# EAGLE design Scope+ArduinoCurveTracerV10 (EAGLE 7.3.0)
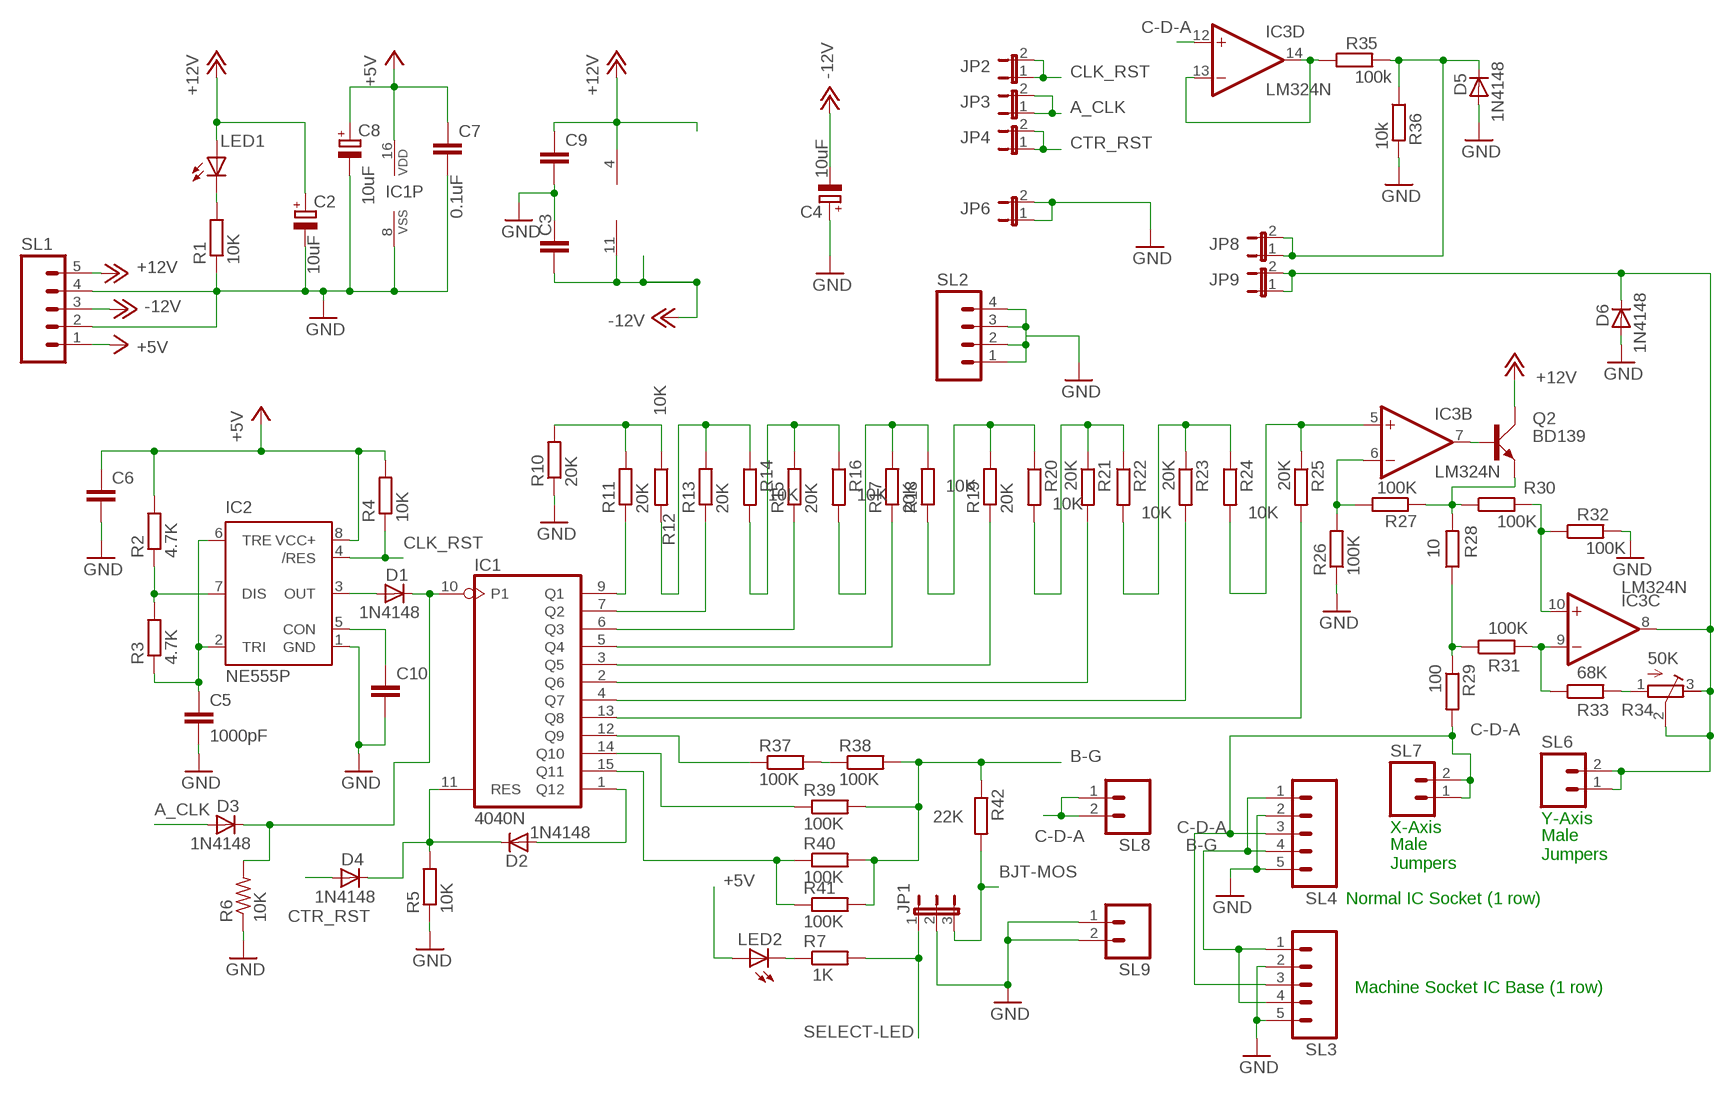
[diagram p0: schematic, sheet 1]

## Parts
C2  10uF  CPOL-EUE2-5  [E2-5]
C3  0.1uF  C-EU025-024X044  [C025-024X044]
C4  10uF  CPOL-EUE2-5  [E2-5]
C5  1000pF  C-EU025-025X050  [C025-025X050]
C6  0.1uF  C-EU025-024X044  [C025-024X044]
C7  0.1uF  C-EU025-024X044  [C025-024X044]
C8  10uF  CPOL-EUE2-5  [E2-5]
C9  0.1uF  C-EU025-024X044  [C025-024X044]
C10  0.1uF  C-EU025-024X044  [C025-024X044]
D1  1N4148  1N4148DO35-7  [DO35-7]
D2  1N4148  1N4148DO35-7  [DO35-7]
D3  1N4148  1N4148DO35-7  [DO35-7]
D4  1N4148  1N4148DO35-7  [DO35-7]
D5  1N4148  1N4148DO35-7  [DO35-7]
D6  1N4148  1N4148DO35-10  [DO35-10]
IC1  4040N  [DIL16]
IC2  NE555P  [DIL-08]
IC3  LM324N  [DIL14]
JP1  JP2E  [JP2]
JP2  JP1E  [JP1]
JP3  JP1E  [JP1]
JP4  JP1E  [JP1]
JP6  JP1E  [JP1]
JP8  JP1E  [JP1]
JP9  JP1E  [JP1]
LED1  LED3MM  [LED3MM]
LED2  LED3MM  [LED3MM]
Q2  BD139  [TO126AV]
R1  10K  R-EU_0204/7  [0204/7]
R2  4.7K  R-EU_0204/7  [0204/7]
R3  4.7K  R-EU_0204/7  [0204/7]
R4  10K  R-EU_0204/7  [0204/7]
R5  10K  R-EU_0204/7  [0204/7]
R6  10K  R-US_0204/7  [0204/7]
R7  1K  R-EU_0204/7  [0204/7]
R10  20K  R-EU_0204/7  [0204/7]
R11  20K  R-EU_0204/7  [0204/7]
R12  10K  R-EU_0204/7  [0204/7]
R13  20K  R-EU_0204/7  [0204/7]
R14  10K  R-EU_0204/7  [0204/7]
R15  20K  R-EU_0204/7  [0204/7]
R16  10K  R-EU_0204/7  [0204/7]
R17  20K  R-EU_0204/7  [0204/7]
R18  10K  R-EU_0204/7  [0204/7]
R19  20K  R-EU_0204/7  [0204/7]
R20  10K  R-EU_0204/7  [0204/7]
R21  20K  R-EU_0204/7  [0204/7]
R22  10K  R-EU_0204/7  [0204/7]
R23  20K  R-EU_0204/7  [0204/7]
R24  10K  R-EU_0204/7  [0204/7]
R25  20K  R-EU_0204/7  [0204/7]
R26  100K  R-EU_0204/7  [0204/7]
R27  100K  R-EU_0204/7  [0204/7]
R28  10  R-EU_0207/10  [0207/10]
R29  100  R-EU_0309/12  [0309/12]
R30  100K  R-EU_0207/10  [0207/10]
R31  100K  R-EU_0204/7  [0204/7]
R32  100K  R-EU_0204/7  [0204/7]
R33  68K  R-EU_0204/7  [0204/7]
R34  50K  R-TRIMM64W  [RTRIM64W]
R35  100k  R-EU_0204/7  [0204/7]
R36  10k  R-EU_0204/7  [0204/7]
R37  100K  R-EU_0204/7  [0204/7]
R38  100K  R-EU_0204/7  [0204/7]
R39  100K  R-EU_0204/7  [0204/7]
R40  100K  R-EU_0204/7  [0204/7]
R41  100K  R-EU_0204/7  [0204/7]
R42  22K  R-EU_0204/7  [0204/7]
SL1  M05  [05P]
SL2  M04  [04P]
SL3  M05  [05P]
SL4  M05  [05P]
SL6  M02  [02P]
SL7  M02  [02P]
SL8  M02  [02P]
SL9  M02  [02P]

## Nets
+5V [power]: C6.1 C7.1 C8.+ IC1.16(VDD) IC2.8(VCC+) LED2.A R2.2 R4.2 SL1.1
+12V [power]: C2.+ C9.1 IC3.4(P:V+) LED1.A Q2.C SL1.5
-12V [power]: C3.2 C4.- IC3.11(P:V-) SL1.3
A_CLK: D3.A JP3.1 JP3.2
B-G: R38.2 R39.2 R40.2 R41.2 R42.1 SL3.1 SL3.4 SL4.1 SL4.4
BJT-MOS: JP1.3 R42.2
C-D-A: IC3.12(D:+IN) R29.2 SL3.3 SL4.3 SL7.1 SL7.2 SL8.1 SL8.2
CLK_RST: IC2.4(/RES) JP2.1 JP2.2 R4.1
CTR_RST: D4.A JP4.1 JP4.2
GND [power]: C2.- C3.1 C4.+ C5.2 C6.2 C7.2 C8.- C9.2 C10.2 D5.A D6.A IC1.8(VSS) IC2.1(GND) JP1.2 JP6.1 JP6.2 R1.1 R5.1 R6.1 R10.1 R26.1 R32.2 R36.2 SL1.2 SL1.4 SL2.1 SL2.2 SL2.3 SL2.4 SL3.2 SL3.5 SL4.2 SL4.5 SL9.1 SL9.2
N$1: IC3.10(C:+IN) R30.2 R32.1
N$2: C10.1 IC2.5(CON)
N$3: R10.2 R11.2 R12.1
N$4: D2.A IC1.1(Q12)
N$5: R12.2 R13.2 R14.1
N$7: R14.2 R15.2 R16.1
N$8: R16.2 R17.2 R18.2
N$9: R18.1 R19.2 R20.1
N$10: R20.2 R21.1 R22.1
N$11: IC1.9(Q1) R11.1
N$12: IC1.7(Q2) R13.1
N$13: IC1.6(Q3) R15.1
N$14: IC1.5(Q4) R17.1
N$15: IC1.3(Q5) R19.1
N$16: IC1.2(Q6) R21.2
N$17: IC1.4(Q7) R23.2
N$18: IC1.13(Q8) R25.2
N$19: R22.2 R23.1 R24.1
N$20: IC3.5(B:+IN) R24.2 R25.1
N$21: R37.2 R38.1
N$22: IC1.14(Q10) R39.1
N$23: IC1.12(Q9) R37.1
N$24: IC3.9(C:-IN) R31.2 R33.1
N$25: Q2.E R27.1 R28.2 R30.1
N$26: LED1.K(C) R1.2
N$27: IC3.6(B:-IN) R26.2 R27.2
N$28: IC3.7(B:OUT) Q2.B
N$29: D1.C D3.C IC1.10(P1) R6.2
N$30: IC1.15(Q11) R40.1 R41.1
N$31: LED2.K(C) R7.1
N$34: R28.1 R29.1 R31.1
N$40: D1.A IC2.3(OUT)
N$41: D2.C D4.C IC1.11(RES) R5.2
N$42: IC2.7(DIS) R2.1 R3.2
N$43: C5.1 IC2.2(TRI) IC2.6(TRE) R3.1
N$44: D6.C IC3.8(C:OUT) JP9.1 JP9.2 R34.2(S) R34.3(A) SL6.1 SL6.2
N$46: D5.C JP8.1 JP8.2 R35.2 R36.1
N$47: IC3.13(D:-IN) IC3.14(D:OUT) R35.1
N$49: R33.2 R34.1(E)
SELECT-LED: JP1.1 R7.2
Unconnected: IC3.1(A:OUT) IC3.2(A:-IN) IC3.3(A:+IN)

## Notes on the sheet
- Y-Axis
- X-Axis
- Male
  Jumpers
- Male
  Jumpers
- Normal IC Socket (1 row)
- Machine Socket IC Base (1 row)

## Library data of the parts
C2 C4 C8 = resistor:CPOL-EU: POLARIZED CAPACITOR, European symbol
C3 C5-C7 C9 C10 = resistor:C-EU: CAPACITOR, European symbol
D1-D6 = diode:1N4148: DIODE high speed (Philips)
IC1 = 40xx:4040: 12-stage binary/ripple COUNTER
IC2 = SparkFun:NE555: General purpose bipolar Timer; MF: Arrow Electronics; MPN: NE555N; OC_FARNELL: 1467742; OC_NEWARK: 89K1486
IC3 = linear:LM324: OP AMP
JP1 = jumper:JP2E: JUMPER
JP2-JP4 JP6 JP8 JP9 = jumper:JP1E: JUMPER
LED1 LED2 = CEDTv81:LED
Q2 = transistor-power:BD139: NPN TRANSISTOR
R1-R5 R7 R10-R33 R35-R42 = resistor:R-EU_: RESISTOR, European symbol
R6 = rcl:R-US_: RESISTOR, American symbol
R34 = resistor:R-TRIMM: Trimm resistor
SL1 SL3 SL4 = con-amp-quick:M05: AMP QUICK CONNECTOR; OC_FARNELL: unknown; OC_NEWARK: unknown
SL2 = con-amp-quick:M04: AMP QUICK CONNECTOR; OC_FARNELL: unknown; OC_NEWARK: unknown
SL6 SL8 SL9 = con-amp-quick:M02: AMP QUICK CONNECTOR; OC_FARNELL: unknown; OC_NEWARK: unknown
SL7 = CEDT_JANUARY_2015_v5:M02: AMP QUICK CONNECTOR

## Net classes
0 default: width 0.61 mm
1 power: width 0.813 mm

## Board
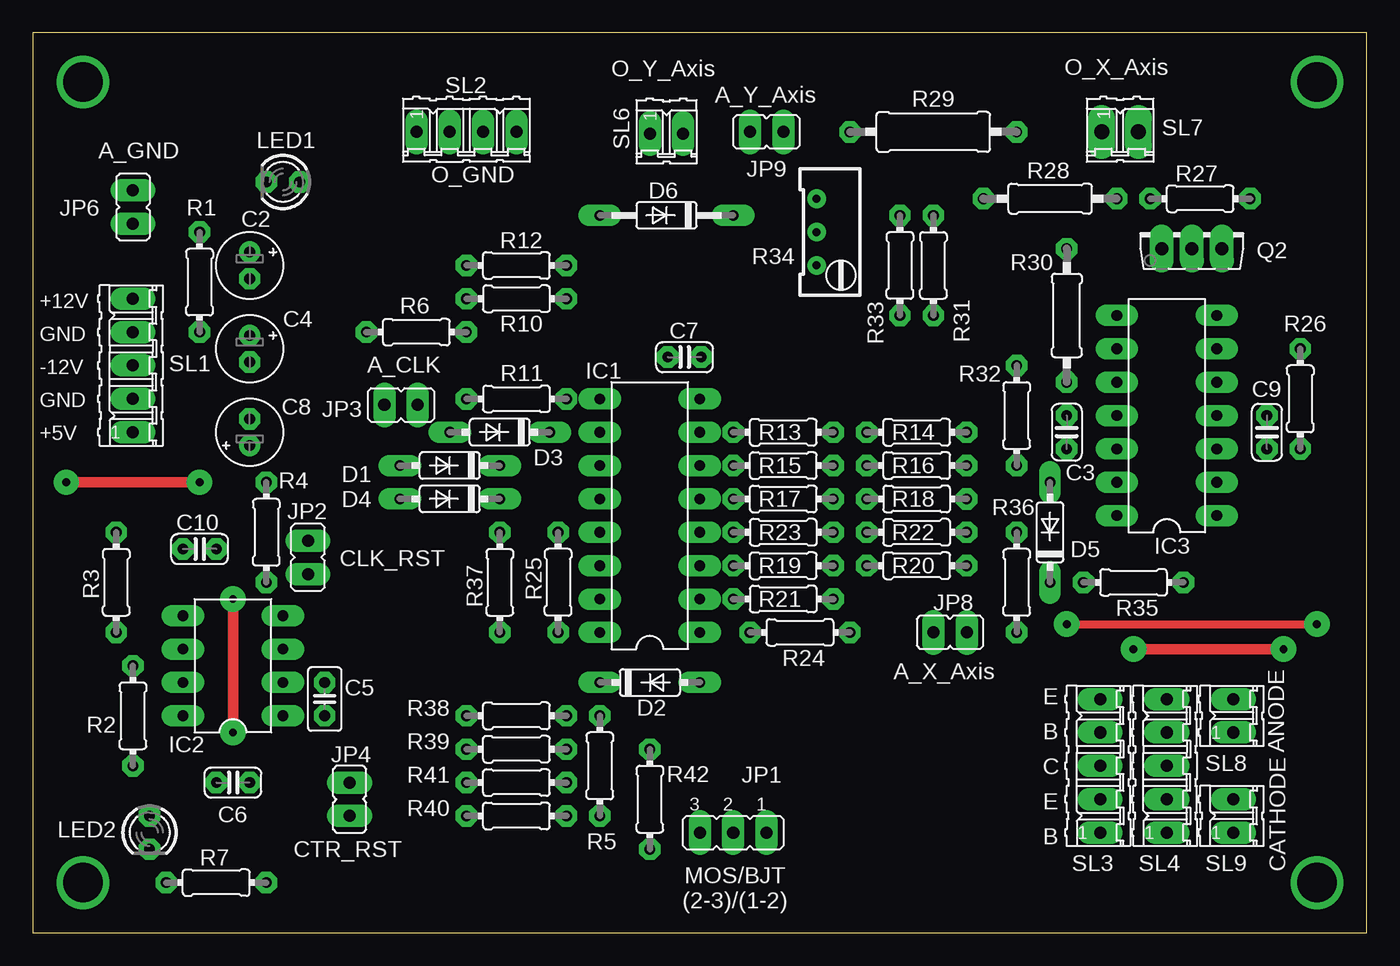
[diagram p1: board, top side]
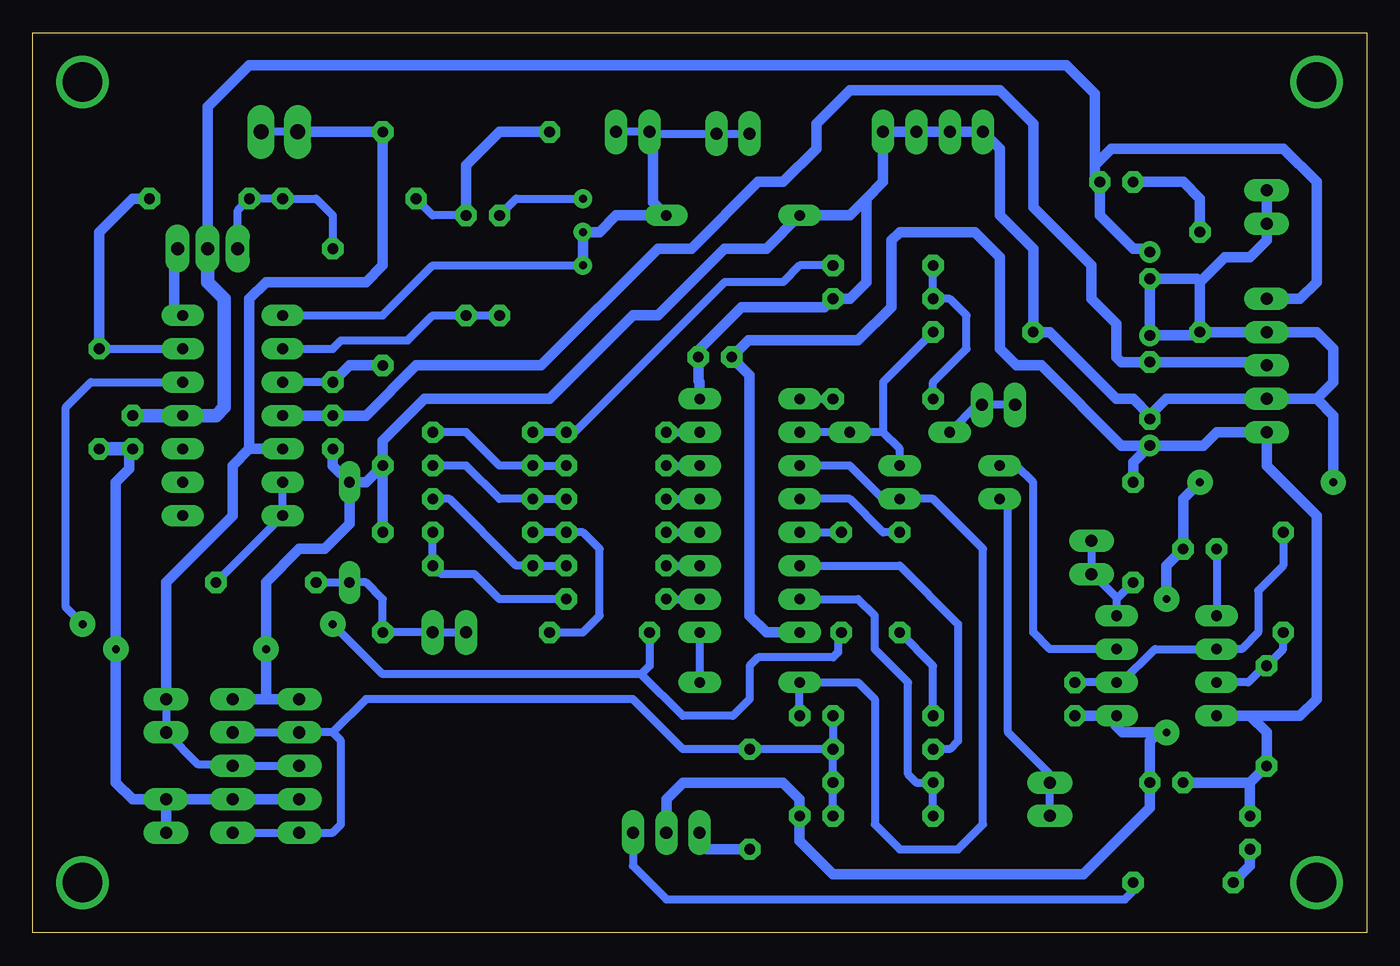
[diagram p2: board, bottom side, seen from below]

Size 101.58 x 68.5 mm. Coordinates in mm from the lower left corner, seen from the top.
Outline: 0,0 101.58,0 101.58,68.5 0,68.5 0,0
Copper layers (1*16): Top 0.035mm / dielectric 1.5mm / Bottom 0.035mm
Design rules "default *": minimum track width 10mil, minimum drill 24mil, track to track 12mil, track to pad 12mil, pad to pad 12mil, via to via 12mil, smd to smd 12mil, copper to edge 40mil, drill to drill 8mil, minimum pad ring 16mil, minimum via ring 16mil, stop-mask expansion 4mil, vias tented up to drill 0mil, thermal gap 10mil

### Footprints (pad centres in the part's own frame; a part is rotated, then mirrored left to right if it is on the bottom)
E2-5 = drill 0.813 pad 1.27: + -1.016,0 | drill 0.813 pad 1.27 octagon: - 1.016,0
C025-024X044 = drill 0.813 octagon: 1 -1.27,0; 2 1.27,0
C025-025X050 = drill 0.813 octagon: 1 -1.27,0; 2 1.27,0
DO35-7 = drill 0.813 long: A 3.81,0; C -3.81,0
DO35-10 = drill 0.813 long: A 5.08,0; C -5.08,0
DIL16 = drill 0.813 long: 1 -8.89,-3.81; 2 -6.35,-3.81; 3 -3.81,-3.81; 4 -1.27,-3.81; 5 1.27,-3.81; 6 3.81,-3.81; 7 6.35,-3.81; 8 8.89,-3.81; 9 8.89,3.81; 10 6.35,3.81; 11 3.81,3.81; 12 1.27,3.81; 13 -1.27,3.81; 14 -3.81,3.81; 15 -6.35,3.81; 16 -8.89,3.81
DIL-08 = drill 0.813 long: 1 -3.81,-3.81; 2 -1.27,-3.81; 3 1.27,-3.81; 4 3.81,-3.81; 5 3.81,3.81; 6 1.27,3.81; 7 -1.27,3.81; 8 -3.81,3.81
DIL14 = drill 0.813 long: 1 -7.62,-3.81; 2 -5.08,-3.81; 3 -2.54,-3.81; 4 0,-3.81; 5 2.54,-3.81; 6 5.08,-3.81; 7 7.62,-3.81; 8 7.62,3.81; 9 5.08,3.81; 10 2.54,3.81; 11 0,3.81; 12 -2.54,3.81; 13 -5.08,3.81; 14 -7.62,3.81
JP2 = drill 0.914 long: 1 -2.54,0; 2 0,0; 3 2.54,0
JP1 = drill 0.914 long: 1 0,-1.27; 2 0,1.27
LED3MM = drill 0.813 octagon: A -1.27,0; K 1.27,0
TO126AV = drill 1.016 long: B 2.286,-1.27; C 0,-1.27; E -2.286,-1.27
0204/7 = drill 0.813 octagon: 1 -3.81,0; 2 3.81,0
0207/10 = drill 0.813 octagon: 1 -5.08,0; 2 5.08,0
0309/12 = drill 0.813 octagon: 1 -6.35,0; 2 6.35,0
RTRIM64W = drill 0.61: 1 1.27,-2.54; 2 1.27,0; 3 1.27,2.54
05P = drill 0.914 long: 1 -5.08,0; 2 -2.54,0; 3 0,0; 4 2.54,0; 5 5.08,0
04P = drill 0.914 long: 1 -3.81,0; 2 -1.27,0; 3 1.27,0; 4 3.81,0
02P = drill 0.914 long: 1 -1.27,0; 2 1.27,0
02P' = drill 1.143 long: 1 -1.397,0; 2 1.397,0

### Placement (x,y rotation side)
C2  16.51,50.8 270 top
C3  78.74,38.1 90 top
C4  16.51,44.45 270 top
C5  22.23,17.78 270 top
C6  15.24,11.43 0 top
C7  49.62,43.81 0 top
C8  16.51,38.1 90 top
C9  93.98,38.1 270 top
C10  12.7,29.21 0 top
D1  31.75,35.56 180 top
D2  46.99,19.05 0 top
D3  35.56,38.1 180 top
D4  31.75,33.02 180 top
D5  77.47,30.48 90 top
D6  48.26,54.61 180 top
IC1  46.99,31.75 90 top
IC2  15.24,20.32 90 top
IC3  86.36,39.37 90 top
JP1  53.34,7.62 180 top
JP2  20.95,28.57 180 top
JP3  28.04,40.18 90 top
JP4  24.13,10.16 180 top
JP6  7.62,55.24 0 top
JP8  69.85,22.86 270 top
JP9  55.88,60.96 270 top
LED1  19.05,57.15 180 top
LED2  8.89,7.62 270 top
Q2  88.27,53.34 0 top
R1  12.7,49.53 90 top
R2  7.62,16.51 270 top
R3  6.35,26.67 270 top
R4  17.78,30.48 90 top
R5  43.18,12.7 90 top
R6  29.21,45.72 0 top
R7  13.97,3.81 0 top
R10  36.83,48.26 180 top
R11  36.83,40.64 180 top
R12  36.83,50.8 0 top
R13  57.15,38.1 0 top
R14  67.31,38.1 0 top
R15  57.15,35.56 0 top
R16  67.31,35.56 0 top
R17  57.15,33.02 0 top
R18  67.31,33.02 180 top
R19  57.15,27.94 0 top
R20  67.31,27.94 0 top
R21  57.15,25.4 180 top
R22  67.31,30.48 180 top
R23  57.15,30.48 180 top
R24  58.42,22.86 180 top
R25  40.01,26.67 90 top
R26  96.52,40.64 90 top
R27  88.9,55.88 0 top
R28  77.47,55.88 0 top
R29  68.58,60.96 0 top
R30  78.74,46.99 270 top
R31  68.58,50.8 270 top
R32  74.93,39.37 270 top
R33  66.04,50.8 90 top
R34  60.96,53.34 180 top
R35  83.82,26.67 180 top
R36  74.93,26.67 90 top
R37  35.56,26.67 270 top
R38  36.83,16.51 0 top
R39  36.83,13.97 0 top
R40  36.83,8.89 0 top
R41  36.83,11.43 0 top
R42  46.99,10.16 270 top
SL1  7.62,43.18 90 top
SL2  33.02,60.96 0 top
SL3  81.28,12.7 90 top
SL4  86.36,12.7 90 top
SL6  48.26,60.83 0 top
SL7  [02P']  82.8,60.96 0 top
SL8  91.44,16.51 90 top
SL9  91.44,8.89 90 top

### Tracks (layer width: path | path; a pad name or v marks a point on that pad's centre or on a via)
+5V
  Bottom 0.813: 7.49,37.72 SL1.1 | 16.89,37.21 C8.+ | 43.69,22.86 IC1.16 45.72,22.86 46.99,24.13 46.99,42.45 C7.1 47.09,45.09 38.73,45.09 36.2,47.62 36.2,52.7 35.56,53.34 29.84,53.34 27.94,51.44 27.94,44.45 26.67,43.18 24.77,43.18 18.67,37.08 C8.+ | C6.1 8.89,11.43 | 8.89,11.43 R2.2 7.62,15.24 8.89,16.51 IC2.8 5.08,16.51 3.81,17.78 3.81,31.75 7.62,35.56 SL1.1 | C8.+ 12.45,37.08 11.43,38.1 SL1.1 | R4.2 17.78,35.81 C8.+ | LED2.A 8.89,11.43
+12V
  Bottom 0.813: 19.94,57.28 LED1.A | LED1.A 20.7,57.28 20.7,58.42 | 20.7,58.42 20.7,63.88 22.86,66.04 85.09,66.04 88.27,62.87 Q2.C | SL1.5 5.08,48.26 3.81,49.53 3.81,57.15 6.35,59.69 19.43,59.69 20.7,58.42 | LED1.A 20.32,54.61 17.78,52.07 16.76,52.07 C2.+
  Bottom 1.016: Q2.C 88.27,49.53 87,48.26 87,40.01 87.63,39.37 IC3.4 C9.1
-12V
  Bottom 0.813: SL1.3 7.87,43.43 C4.- 18.67,43.43 19.05,43.81 19.05,46.35 20.95,48.26 20.95,50.8 25.4,55.24 25.4,61.59 27.94,64.14 39.37,64.14 41.91,61.59 41.91,59.69 44.45,57.15 46.35,57.15 51.44,52.07 53.98,52.07 62.87,43.18 72.39,43.18 76.2,39.37 C3.2 IC3.11
A_CLK
  Bottom 0.61: JP3.2 JP3.1 29.67,40.18 D3.A
B-G
  Bottom 0.61: R40.2 R41.2 R39.2 | R38.2 R39.2 | SL3.1 SL4.1 78.74,7.62 78.11,8.26 78.11,14.61 78.74,15.24 | SL4.4 SL3.4 78.74,15.24 | R39.2 R42.1 52.07,13.97 55.88,17.78 76.2,17.78 78.74,15.24
BJT-MOS
  Bottom 0.813: R42.2 50.24,6.35 50.8,6.91 JP1.3
C-D-A
  Bottom 0.61: SL7.1 SL7.2 | SL3.3 SL4.3 86.61,12.83 89.03,12.83 SL8.1 SL8.2
  Bottom 0.813: SL7.1 R29.2 74.93,50.8 76.2,49.53 83.82,49.53 85.09,48.26 85.09,36.83 | SL8.2 91.44,26.67 86.36,31.75 86.36,35.56 85.09,36.83 | 85.09,36.83 IC3.12
CLK_RST
  Bottom 0.61: JP2.1 JP2.2 20.7,27.18 19.18,25.65 19.05,25.4 | 19.05,25.4 IC2.4 | R4.1 19.05,25.4
CTR_RST
  Bottom 0.61: D4.A 27.3,32.38 27.3,15.24 24.13,12.06 JP4.1 JP4.2
GND  (via drill 0.6 pad 1.93)
  Top 0.813: v15.24,15.24 v15.24,25.4 | v12.7,34.29 v2.54,34.29 | v83.82,21.59 v95.25,21.59
  Bottom 0.813: v15.24,25.4 15.24,27.94 C10.2 13.97,33.02 v12.7,34.29 | C5.2 IC2.1 19.1,16.46 19.1,15.75 18.59,15.24 15.85,15.24 | JP6.2 JP6.1 7.62,52.7 8.89,51.44 10.79,51.44 12.7,49.53 | C8.- 16.64,39.5 16.38,39.5 | R32.2 R36.2 | SL3.2 SL4.2 SL9.2 | C9.2 94.23,36.45 94.23,35.31 95.25,34.29 v95.25,21.59 95.25,11.43 93.98,10.16 SL9.2 | SL9.2 SL9.1 91.06,7.37 | v2.54,34.29 2.54,39.37 3.81,40.64 | 3.81,40.64 SL1.2 15.24,40.64 16.38,39.5 | 3.81,40.64 2.54,41.91 2.54,44.45 3.81,45.72 SL1.4 R1.1 | 12.7,49.53 R1.1 | 12.7,49.53 12.95,49.78 C2.- C4.+ 12.95,45.47 R1.1 | 38.1,55.88 36.83,57.15 SL2.4 SL2.3 SL2.2 SL2.1 27.94,59.69 27.94,54.61 25.4,52.07 R6.1 24.13,45.72 19.05,40.64 17.78,40.64 16.51,39.37 16.38,39.5 | 38.1,55.88 38.1,49.53 39.37,48.26 R10.1 41.27,47.62 47.62,47.62 50.9,44.35 C7.2 50.9,42.01 50.8,41.91 IC1.8 | 38.1,55.88 39.37,54.61 D6.A 45.72,52.07 48.9,52.07 53.98,46.99 55.88,46.99 62.23,40.64 71.75,40.64 74.93,37.47 R32.2 | JP1.2 53.34,10.16 52.07,11.43 44.45,11.43 43.18,10.16 R5.1 43.18,6.99 40.64,4.45 21.59,4.45 16.51,9.53 C6.2 16.51,14.58 15.85,15.24 | SL4.5 83.82,17.78 | 83.82,17.78 SL3.5 | D5.A 77.47,31.11 79.38,29.21 81.28,29.21 83.82,26.67 v83.82,21.59 83.82,17.78 | v15.24,15.24 15.85,15.24 | D5.A 76.2,34.29 R32.2 | C3.1 78.74,35.56 D5.A
  Bottom 1.016: C9.2 R26.1
N$1
  Bottom 0.61: R30.2 IC3.10
  Bottom 0.813: R30.2 77.47,43.18 R32.1
N$2
  Bottom 0.61: C10.1 IC2.5
N$3
  Bottom 0.61: R12.1 R10.2 31.75,48.26 30.48,46.99 30.48,44.45 33.02,41.91 R11.2
N$4
  Bottom 0.61: IC1.1 D2.A
N$5
  Bottom 0.61: R14.1 R13.2 60.33,38.1 48.9,49.53 44.45,49.53 43.18,50.8 R12.2
N$7
  Bottom 0.61: R15.2 R16.1 66.04,35.56 68.58,38.1 R14.2
N$8
  Bottom 0.61: R17.2 R18.2 66.04,33.02 68.58,35.56 R16.2
N$9
  Bottom 0.61: R19.2 R20.1 64.77,27.94 69.85,33.02 R18.1
N$10
  Bottom 0.61: R22.1 R20.2 70.48,27.3 67.94,27.3 66.04,25.4 R21.1
N$11
  Bottom 0.61: IC1.9 R11.1
N$12
  Bottom 0.61: R13.1 IC1.7
N$13
  Bottom 0.61: R15.1 IC1.6
N$14
  Bottom 0.61: R17.1 IC1.5
N$15
  Bottom 0.61: R19.1 IC1.3
N$16
  Bottom 0.61: R21.2 IC1.2
N$17
  Bottom 0.61: R23.2 IC1.4
N$18
  Bottom 0.61: IC1.13 R25.2
N$19
  Bottom 0.61: R22.2 R23.1 59.69,30.48 58.42,29.21 58.42,24.13 59.69,22.86 R24.1
N$20  (via drill 0.6 pad 1.93)
  Top 0.61: v78.74,23.5 v97.79,23.5
  Bottom 0.61: R25.1 40.26,22.86 40.26,21.34 40.64,20.95 46.35,20.95 46.99,20.32 46.99,17.78 48.26,16.51 52.07,16.51 55.24,19.68 | 55.24,19.68 74.93,19.68 v78.74,23.5 | v97.79,23.5 99.06,24.77 99.06,40.01 97.16,41.91 IC3.5 | R24.2 54.61,20.32 55.24,19.68
N$21
  Bottom 0.61: R38.1 33.02,20.32 R37.2
N$22
  Bottom 0.61: IC1.14 35.56,27.94 31.11,23.5 31.11,14.61 31.75,13.97 R39.1
N$23
  Bottom 0.61: R37.1 36.83,30.48 39.37,33.02 IC1.12
N$24
  Bottom 0.61: R33.1 R31.2 71.12,46.99 73.03,45.09 78.11,45.09 78.74,44.45 IC3.9
N$25
  Bottom 0.61: R30.1 78.74,54.61 80.01,55.88 R28.2 R27.1 85.98,54.99 Q2.E
N$26
  Bottom 0.813: R1.2 12.7,55.88 13.97,57.15 LED1.K
N$27
  Bottom 0.61: R26.2 IC3.6
  Bottom 0.813: R27.2 93.98,55.88 96.52,53.34 R26.2
N$28
  Bottom 0.813: IC3.7 90.81,47.62 90.81,51.82 Q2.B
N$29
  Bottom 0.61: D1.C 35.56,36.83 36.83,38.1 | 36.83,38.1 D3.C IC1.10 | R6.2 36.83,41.91 36.83,38.1
N$30
  Bottom 0.61: R40.1 R41.1 34.29,11.43 34.92,12.06 34.92,19.05 37.47,21.59 37.47,24.13 38.73,25.4 IC1.15
N$31
  Bottom 0.813: LED2.K 8.89,5.08 R7.1
N$33  (via drill 3 pad 3.81)
  other vias: 3.81,3.81
N$34
  Bottom 0.61: R31.1 71.12,54.61 R28.1
  Bottom 0.813: R29.1 66.04,60.96 68.58,58.42 R31.1
N$36  (via drill 3 pad 3.81)
  other vias: 97.79,3.81
N$37  (via drill 3 pad 3.81)
  other vias: 97.79,64.77
N$38  (via drill 3 pad 3.81)
  other vias: 3.81,64.77
N$40
  Bottom 0.61: IC2.3 24.13,21.59 25.4,22.86 25.4,34.29 26.67,35.56 D1.A
N$41
  Bottom 0.61: IC1.11 39.37,35.56 36.83,33.02 D4.C 33.02,33.02 29.21,29.21 29.21,8.26 31.11,6.35 35.56,6.35 37.47,8.26 37.47,17.78 38.73,19.05 D2.C R5.2
N$42
  Bottom 0.61: R3.2 6.35,21.59 R2.1 7.87,20.19 9.02,19.05 IC2.7
N$43
  Bottom 0.61: IC2.6 16.13,21.59 18.67,19.05 IC2.2 C5.1 | 11.18,21.46 IC2.6 | R3.1 6.35,27.94 8.26,26.04 8.26,22.86 9.53,21.59 IC2.6
N$44
  Bottom 0.61: SL6.1 SL6.2 54.36,60.83 JP9.1 JP9.2 | IC3.8 74.93,46.99 71.12,50.8 R34.3
  Bottom 0.813: 54.36,60.83 54.36,55.63 D6.C 57.15,54.61 58.42,53.34 R34.2 R34.3
N$46
  Bottom 0.61: JP8.1 JP8.2 R36.1 74.93,25.4 76.2,26.67 D5.C 78,26.67 R35.2
N$47
  Bottom 0.61: IC3.13 IC3.14 R35.1
N$49
  Bottom 0.61: R33.2 64.77,55.88 R34.1
SELECT-LED
  Bottom 0.61: JP1.1 55.88,5.08 53.34,2.54 18.41,2.54 17.78,3.17 R7.2

### Text on the board
tNames: O_Y_Axis | O_X_Axis | A_Y_Axis | A_GND | O_GND | A_CLK | +12V / GND / -12V / GND / +5V | CLK_RST | A_X_Axis | ANODE | CTR_RST | E / B / C / E / B | CATHODE | MOS/BJT / (2-3)/(1-2)
200bmp: v1.0